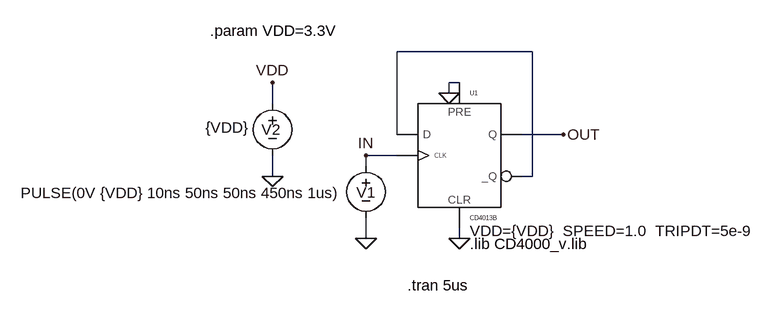
[diagram p0: schematic CD4013_flip_flop.asc]
CD4013_flip_flop.asc, the LTspice schematic file:
Version 4
SHEET 1 880 680
WIRE 320 16 112 16
WIRE 208 64 192 64
WIRE 192 80 192 64
WIRE -80 96 -80 64
WIRE 112 144 112 16
WIRE 368 144 304 144
WIRE 112 176 64 176
WIRE 64 192 64 176
WIRE -80 208 -80 176
WIRE 320 208 320 16
WIRE 320 208 304 208
WIRE 64 304 64 272
WIRE 208 304 208 288
FLAG 208 304 0
FLAG 192 80 0
FLAG 64 304 0
FLAG 64 176 IN
FLAG 368 144 OUT
FLAG -80 208 0
FLAG -80 64 VDD
SYMBOL CD4013B 208 64 R0
WINDOW 39 16 228 Left 2
SYMATTR SpiceLine VDD={VDD}  SPEED=1.0  TRIPDT=5e-9
SYMATTR InstName U1
SYMBOL voltage 64 176 M0
WINDOW 123 0 0 Left 2
WINDOW 39 0 0 Left 2
WINDOW 0 0 57 Center 2
WINDOW 3 38 58 Left 2
SYMATTR InstName V1
SYMATTR Value PULSE(0V {VDD} 10ns 50ns 50ns 450ns 1us)
SYMBOL voltage -80 80 M0
WINDOW 123 0 0 Left 2
WINDOW 39 0 0 Left 2
WINDOW 0 2 56 Center 2
WINDOW 3 36 53 Left 2
SYMATTR InstName V2
SYMATTR Value {VDD}
TEXT 224 312 Left 2 !.lib CD4000_v.lib
TEXT 128 376 Left 2 !.tran 5us
TEXT -176 -16 Left 2 !.param VDD=3.3V

The netlist it stands for:
* CD4013_flip_flop.asc
XU1 0 IN N001 0 OUT N001 VDD 0 CD4013B VDD={VDD}  SPEED=1.0  TRIPDT=5e-9  ; pins PRE CP D CLR Q _Q
V1 IN 0 PULSE(0V {VDD} 10ns 50ns 50ns 450ns 1us)
V2 VDD 0 {VDD}
.lib CD4000_v.lib
.tran 5us
.param VDD=3.3V
.backanno
.end